# EAGLE design ESC-simple_V2A (EAGLE 8.7.1)
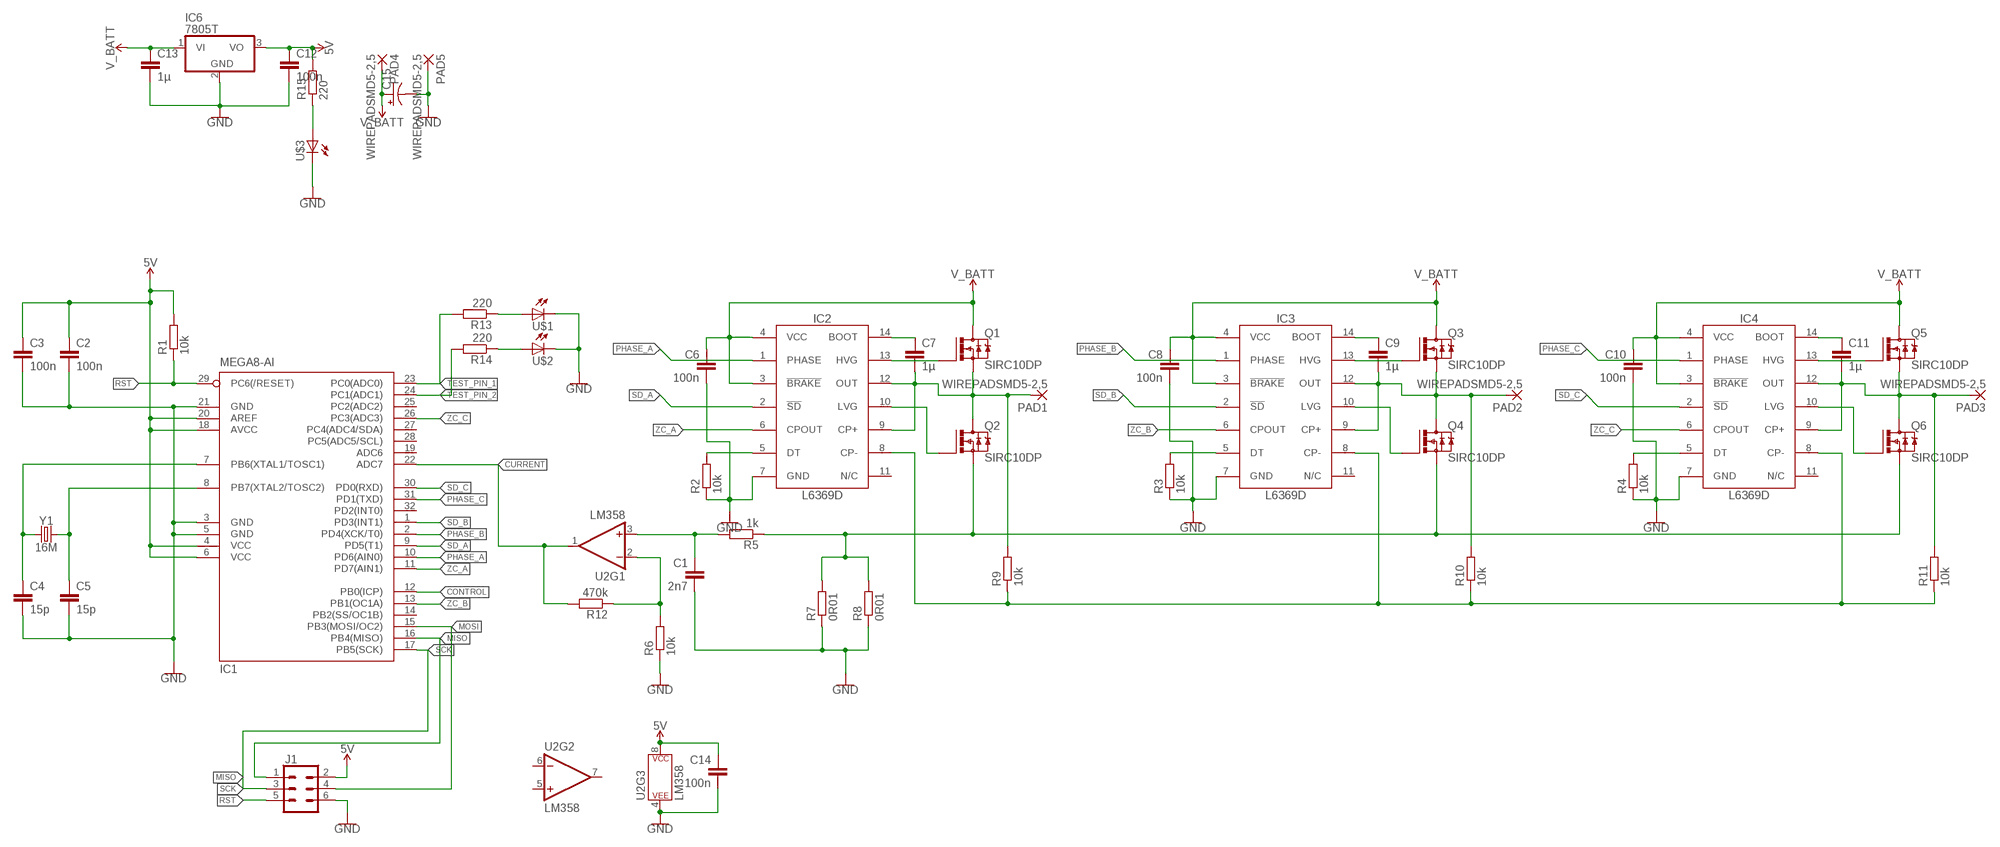
[diagram p0: schematic, sheet 1]

## Parts
C1  2n7  C-EUC1206K  [C1206K]
C2  100n  C-EUC1206K  [C1206K]
C3  100n  C-EUC1206K  [C1206K]
C4  15p  C-EUC1206K  [C1206K]
C5  15p  C-EUC1206K  [C1206K]
C6  100n  C-EUC1206K  [C1206K]
C7  1µ  C-EUC1206K  [C1206K]
C8  100n  C-EUC1206K  [C1206K]
C9  1µ  C-EUC1206K  [C1206K]
C10  100n  C-EUC1206K  [C1206K]
C11  1µ  C-EUC1206K  [C1206K]
C12  100n  C-EUC1206K  [C1206K]
C13  1µ  C-EUC1206K  [C1206K]
C14  100n  C-EUC1206K  [C1206K]
C15  CPOL-USE5-13  [E5-13]
IC1  MEGA8-AI  [TQFP32-08]
IC2  L6369D  [SO-14]
IC3  L6369D  [SO-14]
IC4  L6369D  [SO-14]
IC6  7805T  [TO220H]
J1  CONN_03X22X3_SILK_MALE_PTH  [2X3]
PAD1  WIREPADSMD5-2,5  [5-2,5]
PAD2  WIREPADSMD5-2,5  [5-2,5]
PAD3  WIREPADSMD5-2,5  [5-2,5]
PAD4  WIREPADSMD5-2,5  [5-2,5]
PAD5  WIREPADSMD5-2,5  [5-2,5]
Q1  SIRC10DP  [POWERPAK_SO-8_SINGLE]
Q2  SIRC10DP  [POWERPAK_SO-8_SINGLE]
Q3  SIRC10DP  [POWERPAK_SO-8_SINGLE]
Q4  SIRC10DP  [POWERPAK_SO-8_SINGLE]
Q5  SIRC10DP  [POWERPAK_SO-8_SINGLE]
Q6  SIRC10DP  [POWERPAK_SO-8_SINGLE]
R1  10k  R-EU_R1206  [R1206]
R2  10k  R-EU_R1206  [R1206]
R3  10k  R-EU_R1206  [R1206]
R4  10k  R-EU_R1206  [R1206]
R5  1k  R-EU_R1206  [R1206]
R6  10k  R-EU_R1206  [R1206]
R7  0R01  R-EU_R1206  [R1206]
R8  0R01  R-EU_R1206  [R1206]
R9  10k  R-EU_R1206  [R1206]
R10  10k  R-EU_R1206  [R1206]
R11  10k  R-EU_R1206  [R1206]
R12  470k  R-EU_R1206  [R1206]
R13  220  R-EU_R1206  [R1206]
R14  220  R-EU_R1206  [R1206]
R15  220  R-EU_R1206  [R1206]
U2  LM358  [DIP08]
U$1  LED  [3MM_LED]
U$2  LED  [3MM_LED]
U$3  LED  [3MM_LED]
Y1  16M  CRYSTALSMD-HC49UP  [HC49UP]

## Nets
5V [power]: C2.1 C3.1 C12.1 C14.1 IC1.4(VCC) IC1.6(VCC) IC1.18(AVCC) IC1.20(AREF) IC6.3(VO) J1.2 R1.2 R15.2 U2.8(P$V+)
A: C7.2 IC2.9(CP+) IC2.12(OUT) PAD1.1(P) Q1.1(S) Q1.2(S) Q1.3(S) Q2.5(D) Q2.6(D) Q2.7(D) Q2.8(D) Q2.9(D) R9.2
B: C9.2 IC3.9(CP+) IC3.12(OUT) PAD2.1(P) Q3.1(S) Q3.2(S) Q3.3(S) Q4.5(D) Q4.6(D) Q4.7(D) Q4.8(D) Q4.9(D) R10.2
C: C11.2 IC4.9(CP+) IC4.12(OUT) PAD3.1(P) Q5.1(S) Q5.2(S) Q5.3(S) Q6.5(D) Q6.6(D) Q6.7(D) Q6.8(D) Q6.9(D) R11.2
CONTROL: IC1.12(PB0(ICP))
CURRENT: IC1.22(ADC7) R12.2 U2.1(OUT)
CURRENT_SENSE: Q2.1(S) Q2.2(S) Q2.3(S) Q4.1(S) Q4.2(S) Q4.3(S) Q6.1(S) Q6.2(S) Q6.3(S) R5.1 R7.2 R8.2
GND: C1.2 C2.2 C3.2 C4.2 C5.2 C6.2 C8.2 C10.2 C12.2 C13.2 C14.2 C15.- IC1.3(GND) IC1.5(GND) IC1.21(GND) IC2.7(GND) IC3.7(GND) IC4.7(GND) IC6.2(GND) J1.6 PAD5.1(P) R2.1 R3.1 R4.1 R6.1 R7.1 R8.1 U2.4(P$V-) U$1.C U$2.C U$3.C
MISO: IC1.16(PB4(MISO)) J1.1
MOSI: IC1.15(PB3(MOSI/OC2)) J1.4
N$1: C7.1 IC2.14(BOOT)
N$2: IC2.13(HVG) Q1.4(G)
N$3: IC2.10(LVG) Q2.4(G)
N$4: IC3.5(DT) R3.2
N$5: IC2.5(DT) R2.2
N$6: C9.1 IC3.14(BOOT)
N$7: IC3.13(HVG) Q3.4(G)
N$8: IC3.10(LVG) Q4.4(G)
N$9: R6.2 R12.1 U2.2(-IN)
N$10: IC4.5(DT) R4.2
N$11: C11.1 IC4.14(BOOT)
N$12: IC4.13(HVG) Q5.4(G)
N$13: IC4.10(LVG) Q6.4(G)
N$14: R14.1 U$2.A
N$15: R13.1 U$1.A
N$17: R15.1 U$3.A
N$20: C1.1 R5.2 U2.3(+IN)
PHASE_A: IC1.10(PD6(AIN0)) IC2.1(PHASE)
PHASE_B: IC1.2(PD4(XCK/T0)) IC3.1(PHASE)
PHASE_C: IC1.31(PD1(TXD)) IC4.1(PHASE)
RST: IC1.29(PC6(/RESET)) J1.5 R1.1
SCK: IC1.17(PB5(SCK)) J1.3
SD_A: IC1.9(PD5(T1)) IC2.2(!SD)
SD_B: IC1.1(PD3(INT1)) IC3.2(!SD)
SD_C: IC1.30(PD0(RXD)) IC4.2(!SD)
TEST_PIN_1: IC1.23(PC0(ADC0)) R13.2
TEST_PIN_2: IC1.24(PC1(ADC1)) R14.2
V_BATT [power]: C6.1 C8.1 C10.1 C13.1 C15.+ IC2.3(!BRAKE) IC2.4(VCC) IC3.3(!BRAKE) IC3.4(VCC) IC4.3(!BRAKE) IC4.4(VCC) IC6.1(VI) PAD4.1(P) Q1.5(D) Q1.6(D) Q1.7(D) Q1.8(D) Q1.9(D) Q3.5(D) Q3.6(D) Q3.7(D) Q3.8(D) Q3.9(D) Q5.5(D) Q5.6(D) Q5.7(D) Q5.8(D) Q5.9(D)
V_NEUTRAL: IC2.8(CP-) IC3.8(CP-) IC4.8(CP-) R9.1 R10.1 R11.1
XTAL1: C4.1 IC1.7(PB6(XTAL1/TOSC1)) Y1.1
XTAL2: C5.1 IC1.8(PB7(XTAL2/TOSC2)) Y1.2
ZC_A: IC1.11(PD7(AIN1)) IC2.6(CPOUT)
ZC_B: IC1.13(PB1(OC1A)) IC3.6(CPOUT)
ZC_C: IC1.26(PC3(ADC3)) IC4.6(CPOUT)
Unconnected: IC1.14(PB2(SS/OC1B)) IC1.19(ADC6) IC1.25(PC2(ADC2)) IC1.27(PC4(ADC4/SDA)) IC1.28(PC5(ADC5/SCL)) IC1.32(PD2(INT0)) IC2.11(N/C) IC3.11(N/C) IC4.11(N/C) U2.5(+IN) U2.6(-IN) U2.7(OUT)

## Library data of the parts
C1-C14 = rcl:C-EU: CAPACITOR, European symbol; SPICEPREFIX: C
C15 = rcl:CPOL-US: POLARIZED CAPACITOR, American symbol; SPICEPREFIX: C
IC1 = atmel:MEGA8: MICROCONTROLLER 8 Kbytes FLASH, 1 kbytes SRAM, 512 bytes EEPROM, USART, 6-channel 10 bit ADC, 2-channel 8 bit ADC Pin compatible with Atmega48, ATMega88, ATMega168 Source: avr.lbr; MPN: ATMEGA8-16AU; OC_FARNELL: 9171371; OC_NEWARK: 73M8863
IC2-IC4 = custom-ics:L6369
IC6 = linear:78*: Positive VOLTAGE REGULATOR Source: http://cache.national.com/ds/LM/LM78L05.pdf http://www.fairchildsemi.com/ds/LM/LM7805.pdf
J1 = SparkFun-Connectors:CONN_03X2: Multi connection point. Often used as Generic Header-pin footprint for 0.1 inch spaced/style header connections You can populate with any combo of single row headers, but if you'd like an exact match, check these: Header - 2x3 (Male, 0.1") <https://www.sparkfun.com/products/12807> (PRT-12807) Header - 2x3 (Female, 0.1") <https://www.sparkfun.com/products/13010> (PRT-13010) 2x3 Pin Shrouded Header <https://www.sparkfun.com/products/10877> (PRT-10877) On any of the 0.1 inch spaced packages, you can populate with these: Break Away Headers - Straight <https://www.sparkfun.com/products/116> (PRT-00116) Break Away Male Headers - Right Angle <https://www.sparkfun.com/products/553> (PRT-00553) Female Headers <https://www.sparkfun.com/products/115> (PRT-00115) Break Away Headers - Machine Pin <https://www.sparkfun.com/products/117> (PRT-00117) Break Away Female Headers - Swiss Machine Pin <https://www.sparkfun.com/products/743> (PRT-00743) Special note: the shrouded connector mates well with our 3x2 ribbon cables: Ribbon Crimp Connector - 6-pin (2x3, Female) <https://www.sparkfun.com/products/10651> (PRT-10651) Ribbon Cable - 6 wire (15ft) <https://www.sparkfun.com/products/10646> (PRT-10646); PROD_ID: CONN-09701
PAD1-PAD5 = wirepad:WIREPAD: Wire PAD connect wire on PCB
Q1-Q6 = MOSFET:SIRC10DP: N-Channel 30 V (D-S) MOSFET with Schottky Diode Datasheet <https://www.vishay.com/docs/75189/sirc10dp.pdf>
R1-R15 = rcl:R-EU_: RESISTOR, European symbol; SPICEPREFIX: R
U2 = SparkFun-IC-Amplifiers:LM358: LM358 Jellybean op-amp Datasheet <http://www.sparkfun.com/datasheets/Components/General/LM358.pdf> SparkFun Products Op-Amp (Thru-Hole) - LM358 <https://www.sparkfun.com/products/9456> (COM-09456); PROD_ID: IC-09172
U$1-U$3 = led:LED
Y1 = SparkFun-Clocks:CRYSTAL: Crystals (Generic) These are passive quartz crystals, which can be used as a clock source for a microcontroller. Crystal's are two-terminal devices. They require external "load" capacitors to generate an oscillating signal.

## Net classes
0 default: width 0.305 mm, clearance 0.305 mm
1 power: width 0.305 mm, clearance 0.305 mm

## Board
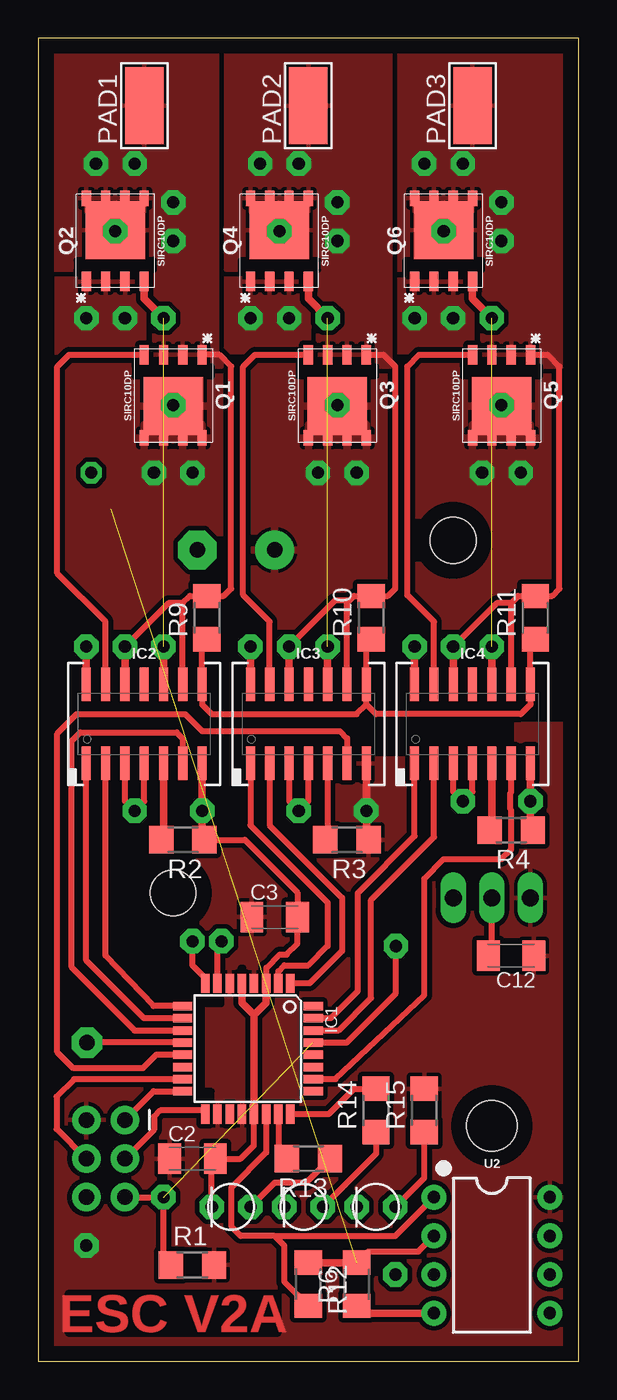
[diagram p1: board, top side]
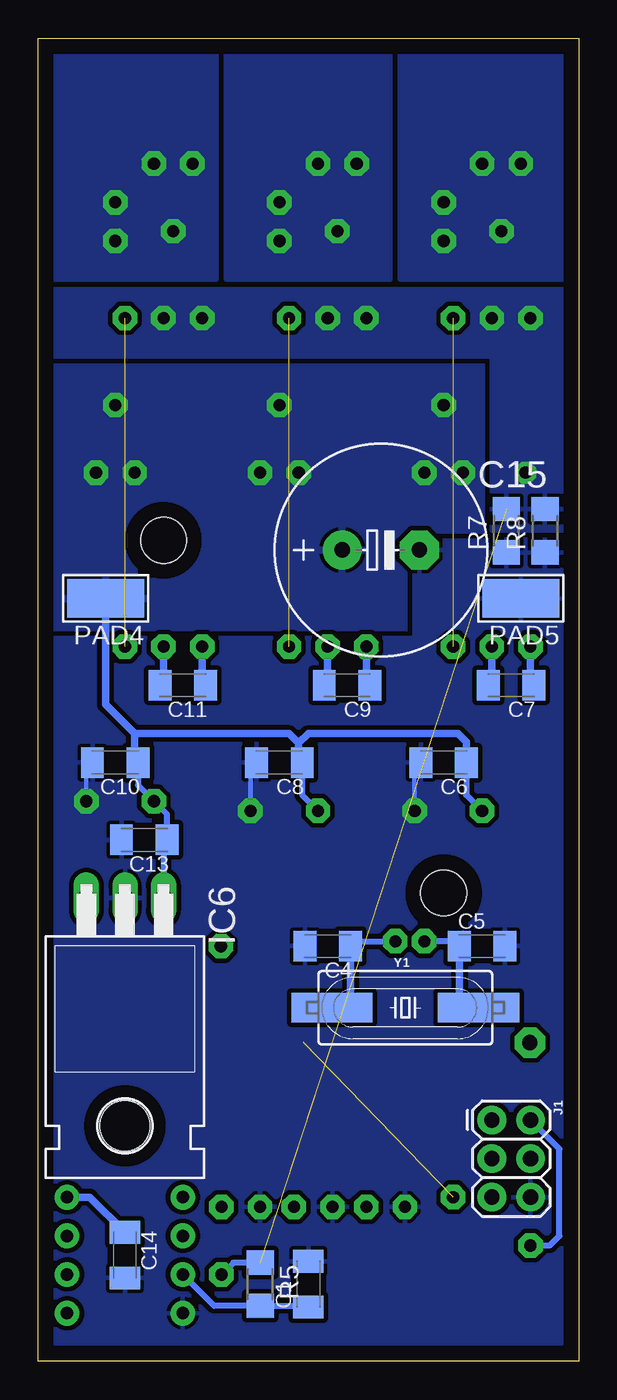
[diagram p2: board, bottom side, seen from below]

Size 35.56 x 87 mm. Coordinates in mm from the lower left corner, seen from the top.
Outline: 0,0 35.56,0 35.56,87 0,87 0,0
Copper layers (1*16): Top 0.035mm / dielectric 1.5mm / Bottom 0.035mm
Design rules "default": minimum track width 6mil, minimum drill 0.35mm, track to track 6mil, track to pad 6mil, pad to pad 6mil, via to via 6mil, smd to smd 6mil, copper to edge 40mil, drill to drill 6mil, minimum pad ring 10mil, minimum via ring 8mil, stop-mask expansion 4mil, vias tented up to drill 0mil, thermal gap 10mil
Holes 3 mm at 8.89,30.8 27.3,53.98
tRestrict: area 2.5,71.8 to 7.6,72.4; area 13.3,71.8 to 18.4,72.4; area 24.1,71.8 to 29.2,72.4; area 10.2,17.1 to 12.1,24.1; area 14,23.5 to 14.6,24.1; area 13.3,25.4 to 13.5,25.9; area 6.4,64.8 to 11.4,65.4; area 17.1,64.8 to 22.2,65.4; area 27.9,64.8 to 33,65.4; area 20.3,40 to 31.1,42.5; area 15.6,12.4 to 20,14.3; area 7.9,5.4 to 11.1,7.3; 7 more areas
bRestrict: area 13,43.5 to 17.5,45.4; area 23.8,43.5 to 28.3,45.4; area 6.7,38.4 to 9.8,40.3; area 17.5,38.4 to 20.6,40.3; area 28.3,38.4 to 31.4,40.3; area 26.4,33.3 to 29.5,35.2; area 14.3,26.4 to 17.5,28.3; area 5.4,26.4 to 8.6,28.3; area 16.8,2.9 to 18.7,6; area 28.9,6 to 30.8,9.2

### Footprints (pad centres in the part's own frame; a part is rotated, then mirrored left to right if it is on the bottom)
C1206K = smd 1.5 x 2: 1 -1.5,0; 2 1.5,0
E5-13 = drill 1.016 pad 2.54: + -2.54,0 | drill 1.016 pad 2.54 octagon: - 2.54,0
TQFP32-08 = smd 1.27 x 0.559: 1 -4.293,2.8; 2 -4.293,2; 3 -4.293,1.2; 4 -4.293,0.4; 5 -4.293,-0.4; 6 -4.293,-1.2; 7 -4.293,-2; 8 -4.293,-2.8; 17 4.293,-2.8; 18 4.293,-2; 19 4.293,-1.2; 20 4.293,-0.4; 21 4.293,0.4; 22 4.293,1.2; 23 4.293,2; 24 4.293,2.8 | smd 0.559 x 1.27: 9 -2.8,-4.293; 10 -2,-4.293; 11 -1.2,-4.293; 12 -0.4,-4.293; 13 0.4,-4.293; 14 1.2,-4.293; 15 2,-4.293; 16 2.8,-4.293; 25 2.8,4.293; 26 2,4.293; 27 1.2,4.293; 28 0.4,4.293; 29 -0.4,4.293; 30 -1.2,4.293; 31 -2,4.293; 32 -2.8,4.293
SO-14 = smd 0.6 x 2.2: 1 -3.81,-2.6; 2 -2.54,-2.6; 3 -1.27,-2.6; 4 0,-2.6; 5 1.27,-2.6; 6 2.54,-2.6; 7 3.81,-2.6; 8 3.81,2.6; 9 2.54,2.6; 10 1.27,2.6; 11 0,2.6; 12 -1.27,2.6; 13 -2.54,2.6; 14 -3.81,2.6
TO220H = drill 1.118 long: 1 -2.54,-10.16; 2 0,-10.16; 3 2.54,-10.16 | hole 3.302: 0,4.826
2X3 = drill 1.016 pad 1.88: 1 0,0; 2 0,2.54; 3 2.54,0; 4 2.54,2.54; 5 5.08,0; 6 5.08,2.54
5-2,5 = smd 2.54 x 5.08: 1 0,0
POWERPAK_SO-8_SINGLE = smd 1.27 x 0.61: 1 -2.67,1.905; 2 -2.67,0.635; 3 -2.67,-0.635; 4 -2.67,-1.905 | smd 1.02 x 0.61: 5 2.795,-1.905; 6 2.795,-0.635; 7 2.795,0.635; 8 2.795,1.905 | smd 3.81 x 3.91: 9 0.69,0
R1206 = smd 1.6 x 1.803: 1 -1.422,0; 2 1.422,0
DIP08 = drill 0.813 pad 1.626: 1 -3.81,-3.81; 2 -1.27,-3.81; 3 1.27,-3.81; 4 3.81,-3.81; 5 3.81,3.81; 6 1.27,3.81; 7 -1.27,3.81; 8 -3.81,3.81
3MM_LED = drill 0.8 pad 1.6 octagon: A -1.27,0; C 1.27,0
HC49UP = smd 5.334 x 1.93: 1 -4.826,0; 2 4.826,0

### Placement (x,y rotation side)
C1  17.78,5.08 90 bottom
C2  10.16,13.34 0 top
C3  15.56,29.21 0 top
C4  16.51,27.3 180 bottom
C5  6.35,27.3 0 bottom
C6  8.89,39.37 180 bottom
C7  4.45,44.45 180 bottom
C8  19.69,39.37 180 bottom
C9  15.24,44.45 180 bottom
C10  30.48,39.37 180 bottom
C11  26.04,44.45 180 bottom
C12  31.12,26.67 180 top
C13  28.58,34.29 180 bottom
C14  29.84,6.99 270 bottom
C15  13.02,53.34 0 bottom
IC1  13.81,20.56 270 top
IC2  6.99,41.91 0 top
IC3  17.78,41.91 0 top
IC4  28.58,41.91 0 top
IC6  29.84,20.32 180 bottom
J1  5.72,15.88 270 bottom
PAD1  6.99,82.55 0 top
PAD2  17.78,82.55 0 top
PAD3  28.58,82.55 0 top
PAD4  31.12,50.16 90 bottom
PAD5  3.81,50.16 90 bottom
Q1  8.89,63.5 270 top
Q2  5.08,73.66 90 top
Q3  19.69,63.5 270 top
Q4  15.88,73.66 90 top
Q5  30.48,63.5 270 top
Q6  26.67,73.66 90 top
R1  10.16,6.35 0 top
R2  9.53,34.29 180 top
R3  20.32,34.29 180 top
R4  31.12,34.92 180 top
R5  20.96,5.08 270 bottom
R6  20.96,5.08 90 top
R7  4.76,54.61 90 bottom
R8  2.22,54.61 90 bottom
R9  11.11,48.9 90 top
R10  21.91,48.9 90 top
R11  32.7,48.9 90 top
R12  17.78,5.08 270 top
R13  17.78,13.34 180 top
R14  22.23,16.51 90 top
R15  25.4,16.51 90 top
U2  29.84,6.99 270 top
U$1  12.7,10.16 180 top
U$2  17.46,10.16 180 top
U$3  22.23,10.16 180 top
Y1  11.41,23.25 0 bottom

### Tracks (layer width: path | path; a pad name or v marks a point on that pad's centre or on a via)
5V  (via drill 0.8 pad 1.6)
  Bottom 0.406: v3.18,7.62 1.91,7.62 1.27,8.26 1.27,13.97 J1.2
  Bottom 0.508: C14.1 32.16,10.79 U2.8
  pour Top (rank 4): 36.2,41.91 -0.63,41.91 -0.63,-0.63 36.2,-0.63
A  (via drill 0.8 pad 1.6)
  Top 0.305: Q2.8 3.18,76.25
  Top 0.406: Q1.1 11.94,66.17 12.7,65.41 12.7,50.8 12.22,50.32 R9.2 10,50.32 9.53,49.85 | IC2.9 9.53,49.85 | 9.53,49.85 8.57,49.85 v5.72,46.99
  Top 0.508: v5.72,46.99 IC2.12
  Bottom 0.305: 5.72,44.77 C7.2
  Bottom 0.508: v5.72,46.99 5.72,44.77
  other vias: 3.81,78.74 6.35,78.74 8.89,76.2 8.89,73.66 5.08,74.3
  pour Top (rank 3): -0.63,71.75 12.7,71.75 12.7,87.63 -0.63,87.63
  pour Top (rank 3): 7.62,77.47 7.62,65.41 12.07,65.41 12.07,77.47
  pour Bottom (rank 2): 11.75,71.12 11.75,87.63 -0.63,87.63 -0.63,71.12
B  (via drill 0.8 pad 1.6)
  Top 0.305: Q4.8 13.97,76.25
  Top 0.406: Q3.1 22.73,66.17 23.5,65.41 23.5,50.8 23.01,50.32 R10.2 20.79,50.32 20.48,50.01 | IC3.9 20.32,49.85 20.48,50.01 | 20.48,50.01 19.53,50.01 v16.51,46.99
  Top 0.508: IC3.12 v16.51,46.99
  Bottom 0.305: 16.51,44.77 C9.2
  Bottom 0.508: v16.51,46.99 16.51,44.77
  other vias: 14.61,78.74 17.14,78.74 19.69,76.2 19.69,73.66 15.88,74.3
  pour Top: 18.42,65.41 23.18,65.41 23.18,87.63 12.38,87.63 12.38,71.75 18.42,71.75
  pour Bottom: 12.38,87.63 12.38,71.12 23.18,71.12 23.18,87.63
C  (via drill 0.8 pad 1.6)
  Top 0.406: Q5.1 33.52,66.17 34.29,65.41 34.29,50.8 33.81,50.32 R11.2 31.59,50.32 31.12,49.85 | IC4.9 31.12,49.85 | 31.12,49.85 30.16,49.85 v27.3,46.99
  Top 0.508: IC4.12 v27.3,46.99
  Bottom 0.305: 27.3,44.77 C11.2
  Bottom 0.508: v27.3,46.99 27.3,44.77
  other vias: 25.4,78.74 27.94,78.74 30.48,76.2 30.48,73.66 26.67,74.3
  pour Top (rank 3): 22.23,87.63 22.23,71.75 36.2,71.75 36.2,87.63
  pour Top: 29.21,65.41 29.21,77.47 36.83,77.47 36.83,65.41
  pour Bottom (rank 2): 23.81,71.12 23.81,87.63 36.83,87.63 36.83,71.12
CONTROL  (via drill 1 pad 2)
  Top 0.406: IC1.12 v3.21,20.96 v3.21,20.95
CURRENT
  Top 0.406: 15.56,8.26 23.5,8.26 U2.1 | 15.56,8.26 16.19,7.62 16.19,5.25 R12.2 | 15.56,8.26 13.34,8.26 12.7,8.89 12.7,11.43 15.01,13.73 IC1.22
CURRENT_SENSE  (via drill 0.8 pad 1.4, 0.8 pad 1.6)  (1 unrouted)
  Bottom 0.406: R5.1 22.71,6.5 v23.5,5.72
  other vias: 5.72,68.58 16.51,68.58 27.3,68.58 3.18,68.58 13.97,68.58 24.77,68.58 3.49,58.42
  pour Bottom (rank 3): 40.64,66.04 40.64,70.48 -4.45,70.48 -4.45,54.61 5.72,54.61 5.72,66.04
  pour Top (rank 2): 12.38,71.75 18.42,71.75 18.42,66.36 12.38,66.36
  pour Top (rank 4): 0.64,71.75 6.99,71.75 6.99,65.41 0.64,65.41
  pour Top (rank 2): 22.86,71.12 28.58,71.12 28.58,66.36 22.86,66.36
GND  (via drill 0.8 pad 1.6)
  Top 0.305: R2.1 10.8,35.25 | R3.1 21.59,35.25 | 32.39,35.25 R4.1 | R6.1 21.11,3.18
  Top 0.406: 15.01,25.89 15.01,25.4 | 15.01,25.4 IC1.3 | 14.19,16.26 IC1.21 14.21,14.21 13.34,13.34 C2.2 11.43,13.11 U$1.C | C12.2 29.84,26.9 IC6.2 | 15.01,25.4 15.02,25.41 15.02,25.87 15.9,26.75 16.35,26.75 17.06,27.45 C3.2 17.06,30.83 13.6,34.29 R2.1
  Top 0.508: IC2.7 v10.8,36.2 10.8,35.25 | IC3.7 v21.59,36.2 21.59,35.25 | IC4.7 v32.39,36.83 32.39,35.25 | 21.11,3.18 U2.4 | IC1.21 14.21,22.78 | IC1.3 15.01,23.58 14.21,22.78 | 14.21,22.78 13.41,23.58 IC1.5
  Bottom 0.305: v10.8,36.2 10.8,38.41 C6.2 | v21.59,36.2 21.59,38.41 C8.2 | v32.39,36.83 32.39,38.41 C10.2
  Bottom 0.508: 4.13,49.85 PAD5.1
  pour Bottom (rank 6): -3.17,88.27 -3.17,-2.54 41.28,-2.54 41.28,88.27
  pour Bottom: -1.27,53.98 10.8,53.98 10.8,46.99 -1.27,46.99
  pour Top: 18.42,21.59 21.59,21.59 26.04,26.04 26.04,38.73 27.3,40 31.12,40 32.39,41.27 32.39,42.55 31.75,43.18 16.51,43.18 18.42,42.55
MISO
  Top 0.305: IC1.16 9.49,17.78
  Top 0.406: J1.1 7.6,17.76 IC1.16
MOSI
  Top 0.406: IC1.15 2.37,18.56 1.22,17.41 1.22,15.29 J1.4
N$1  (via drill 0.8 pad 1.6)
  Top 0.508: IC2.14 v3.18,46.99
  Bottom 0.305: 3.18,44.77 C7.1
  Bottom 0.508: v3.18,46.99 3.18,44.77
N$2
  Top 0.406: Q1.4 2.04,66.17 1.27,65.41 1.27,51.8 4.45,48.62 IC2.13
N$3  (via drill 0.8 pad 1.6)  (1 unrouted)
  Top 0.508: IC2.10 v8.26,46.99 | Q2.4 6.99,69.85 v8.26,68.58
N$4
  Top 0.406: IC3.5 19.05,34.44 R3.2
N$5
  Top 0.305: R2.2 8.26,35.25
  Top 0.508: 8.26,35.25 IC2.5
N$6  (via drill 0.8 pad 1.6)
  Top 0.508: IC3.14 v13.97,46.99
  Bottom 0.305: 13.97,44.77 C9.1
  Bottom 0.508: v13.97,46.99 13.97,44.77
N$7
  Top 0.406: Q3.4 14.26,66.17 13.49,65.41 13.49,50.37 15.24,48.62 IC3.13
N$8  (via drill 0.8 pad 1.6)  (1 unrouted)
  Top 0.508: IC3.10 v19.05,46.99 | Q4.4 17.78,69.85 v19.05,68.58
N$9
  Top 0.406: R6.2 20.99,6.5 21.73,7.24 25.02,7.24 U2.2
  Top 0.508: R12.1 R6.2
N$10
  Top 0.305: 29.84,35.25 R4.2
  Top 0.508: IC4.5 29.84,35.25
N$11  (via drill 0.8 pad 1.6)
  Top 0.508: IC4.14 v24.77,46.99
  Bottom 0.305: 24.77,44.77 C11.1
  Bottom 0.508: v24.77,46.99 24.77,44.77
N$12
  Top 0.406: Q5.4 25.05,66.17 24.29,65.41 24.29,50.37 26.04,48.62 IC4.13
N$13  (via drill 0.8 pad 1.6)  (1 unrouted)
  Top 0.508: IC4.10 v29.84,46.99 | Q6.4 28.58,69.85 v29.84,68.58
N$14
  Top 0.406: R14.1 22.23,13.65 U$2.A
N$15
  Top 0.406: R13.1 17.61,11.75 15.56,11.75 U$1.A
N$17
  Top 0.406: U$3.A 25.4,12.07 R15.1
N$20
  Bottom 0.406: U2.3 23.98,3.66 R5.2 17.86,3.66 C1.1
PHASE_A
  Top 0.406: IC1.10 6.97,22.56 3.18,26.35 IC2.1
PHASE_B
  Top 0.406: IC1.2 15.81,25.65 16.19,26.04 17.78,26.04 19.05,27.3 19.05,30.16 13.97,35.24 IC3.1
PHASE_C
  Top 0.406: IC1.31 18.11,22.57 19.26,22.57 21.03,24.34 21.03,30.8 24.77,34.53 IC4.1
RST  (via drill 0.8 pad 1.6)  (1 unrouted)
  Top 0.406: IC1.29 18.11,20.97 20.31,20.97 23.53,24.2 v23.53,27.3 | 8.89,6.5 R1.1 8.26,6.83 v8.26,10.79 J1.5
SCK
  Top 0.305: 10.76,16.51 10.78,16.49 IC1.17
  Top 0.406: 10.78,16.49 8.03,16.49 7.62,16.08 7.62,15.24 J1.3
SD_A
  Top 0.406: IC1.9 7.6,23.36 4.45,26.67 IC2.2
SD_B
  Top 0.406: IC3.2 15.24,35.24 20,30.48 20,26.99 17.87,24.85 IC1.1
SD_C
  Top 0.406: IC1.30 18.11,21.77 19.78,21.77 21.91,23.9 21.91,30.35 26.04,34.48 IC4.2
TEST_PIN_1
  Top 0.406: IC1.23 15.81,13.89 R13.2
TEST_PIN_2
  Top 0.406: IC1.24 19.12,16.27 20.79,17.93 R14.2
V_BATT  (via drill 0.8 pad 1.6)
  Top 0.406: IC2.4 6.99,36.83 v6.35,36.2 5.72,36.83 IC2.3 | IC3.3 16.51,36.83 v17.14,36.2 17.78,36.83 IC3.4 | IC4.3 27.3,37.47 v27.94,36.83 28.58,37.47 IC4.4
  Bottom 0.406: C6.1 7.39,37.23 v6.35,36.2 | C8.1 18.19,37.23 v17.14,36.2 | C10.1 28.98,37.87 v27.94,36.83 27.08,35.97 C13.1 27.3,34.06 IC6.1
  Bottom 0.508: PAD4.1 31.12,43.18 29.21,41.27 | 18.42,40.64 19.05,41.27 29.21,41.27 | 18.42,40.64 17.79,41.27 7.94,41.27 7.39,40.73 C6.1 | C10.1 29.21,39.6 29.21,41.27 | 18.42,40.64 18.42,39.6 C8.1
  other vias: 7.62,58.42 10.16,58.42 18.42,58.42 20.96,58.42 29.21,58.42 31.75,58.42 8.89,62.87 19.69,62.87 30.48,62.87
  pour Bottom (rank 4): 5.72,65.41 40.01,65.41 40.01,48.26 5.72,48.26
  pour Top (rank 4): 41.91,65.41 -6.35,65.41 -6.35,44.45 41.91,44.45
V_NEUTRAL
  Top 0.305: 32.39,47.16 R11.1 | 10.8,47.16 R9.1 | 21.59,47.16 R10.1
  Top 0.406: 21.59,43.18 20.96,42.55 11.43,42.55 10.8,43.18 IC2.8 10.8,47.16 | 21.59,43.18 IC3.8 21.59,47.16 | 21.59,43.18 22.23,42.55 31.75,42.55 32.39,43.18 IC4.8 32.39,47.16
XTAL1  (via drill 0.8 pad 1.6)
  Top 0.406: IC1.7 11.81,27.36 v12.07,27.62
  Bottom 0.406: C4.1 14.69,27.62 v12.07,27.62
  Bottom 0.508: C4.1 15.01,23.73 15.49,23.25 Y1.1
XTAL2  (via drill 0.8 pad 1.6)
  Top 0.406: IC1.8 11.01,25.19 10.16,26.04 v10.16,27.62
  Bottom 0.406: C5.1 8.17,27.62 v10.16,27.62
  Bottom 0.508: C5.1 7.85,23.73 7.38,23.25 Y1.2
ZC_A
  Top 0.406: IC2.6 9.53,40.96 9.13,41.36 2.79,41.36 2.22,40.79 2.22,25.89 6.35,21.76 IC1.11
ZC_B
  Top 0.406: IC3.6 20.32,40.96 19.84,41.43 10.8,41.43 9.68,42.55 2.54,42.55 1.27,41.27 1.27,20.32 2.32,19.27 6.89,19.27 7.78,20.16 IC1.13
ZC_C
  Top 0.406: IC1.26 18.11,18.57 19.58,18.57 25.4,24.08 25.4,31.75 26.67,33.02 30.48,33.02 31.12,33.66 31.12,36.25 31.08,36.29 31.08,37.37 31.12,37.41 IC4.6

### Text on the board
Top: ESC V2A